# EAGLE schematic buttons (EAGLE 6.5.0)
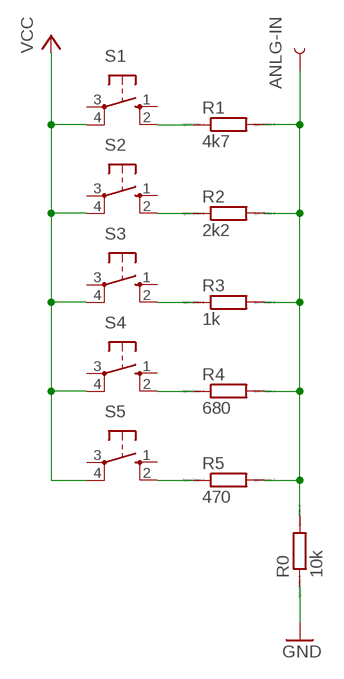
[diagram p0: schematic, sheet 1]

## Parts
ANLG-IN  TEST-POINT2  [PAD.02X.02]
R0  10k  R0204/7  [0204/7]
R1  4k7  R0204/7  [0204/7]
R2  2k2  R0204/7  [0204/7]
R3  1k  R0204/7  [0204/7]
R4  680  R0204/7  [0204/7]
R5  470  R0204/7  [0204/7]
S1  10-XX  [B3F-10XX]
S2  10-XX  [B3F-10XX]
S3  10-XX  [B3F-10XX]
S4  10-XX  [B3F-10XX]
S5  10-XX  [B3F-10XX]

## Nets
ANALOG_PIN: ANLG-IN.P$1 R0.2 R1.2 R2.2 R3.2 R4.2 R5.2
GND: R0.1
N$1: R1.1 S1.2(S1)
N$2: R2.1 S2.2(S1)
N$3: R3.1 S3.2(S1)
N$4: R4.1 S4.2(S1)
N$5: R5.1 S5.2(S1)
VCC: S1.4(P1) S2.4(P1) S3.4(P1) S4.4(P1) S5.4(P1)
Unconnected: S1.1(S) S1.3(P) S2.1(S) S2.3(P) S3.1(S) S3.3(P) S4.1(S) S4.3(P) S5.1(S) S5.3(P)

## Library data of the parts
ANLG-IN = SparkFun-Passives:TEST-POINT: Bare copper test points for troubleshooting or ICT
R0 R1-R5 = eagle-ltspice:R: RESISTOR, European symbol; SPICEMODEL: NONE; SPICEPREFIX: R
S1-S5 = switch-omron:10-XX: OMRON SWITCH; MPN: B3F-1000; OC_FARNELL: 176432; OC_NEWARK: 36M3542